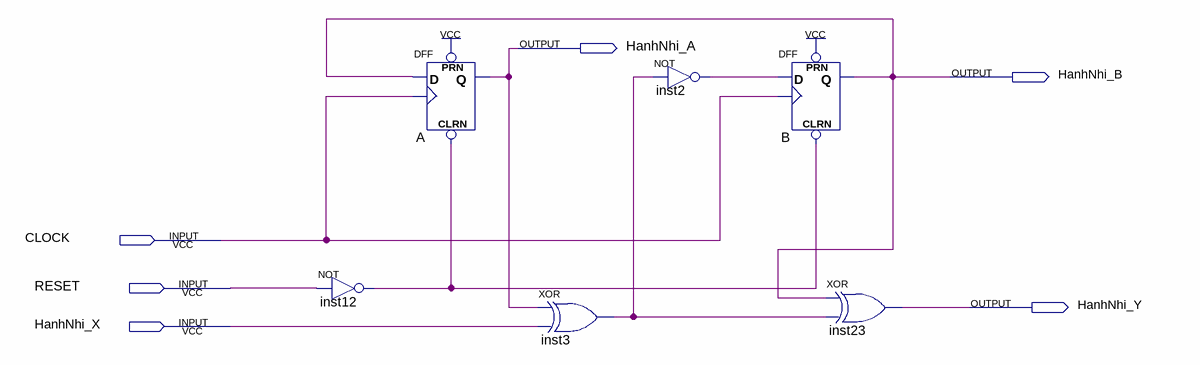
[diagram p0: schematic sheet]
// Quartus schematic Assignment4.bdf as structural Verilog: 6 symbols, 6 pins
module Assignment4 (
  input  CLOCK,
  input  RESET,
  input  HanhNhi_X,
  output HanhNhi_A,
  output HanhNhi_B,
  output HanhNhi_Y
);

  wire inst2_out, inst3_out, inst12_out;

  not inst12 (inst12_out, RESET);
  DFF A (.CLRN(inst12_out), .CLK(CLOCK), .D(HanhNhi_B), .PRN(1'b1), .Q(HanhNhi_A));
  xor inst3 (inst3_out, HanhNhi_A, HanhNhi_X);
  not inst2 (inst2_out, inst3_out);
  DFF B (.CLRN(inst12_out), .CLK(CLOCK), .D(inst2_out), .PRN(1'b1), .Q(HanhNhi_B));
  xor inst23 (HanhNhi_Y, HanhNhi_B, inst3_out);
endmodule
